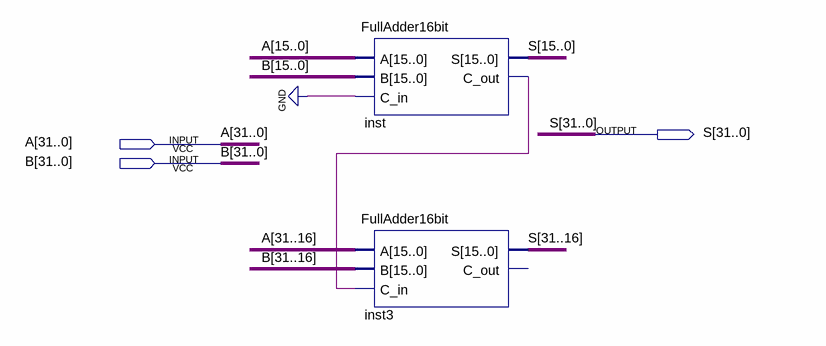
[diagram p0: schematic sheet]
// Quartus schematic FA-32bits.bdf as structural Verilog: 2 symbols, 3 pins
module \FA-32bits  (
  input  [31:0] A,
  input  [31:0] B,
  output [31:0] S
);

  wire inst_c_out;

  FullAdder16bit inst (.A(A[15:0]), .B(B[15:0]), .C_in(1'b0), .S(S[15:0]), .C_out(inst_c_out));
  FullAdder16bit inst3 (.A(A[31:16]), .B(B[31:16]), .C_in(inst_c_out), .S(S[31:16]));  // open: C_out
endmodule
